# EAGLE design 512kB-v11 (EAGLE 8.3.1)
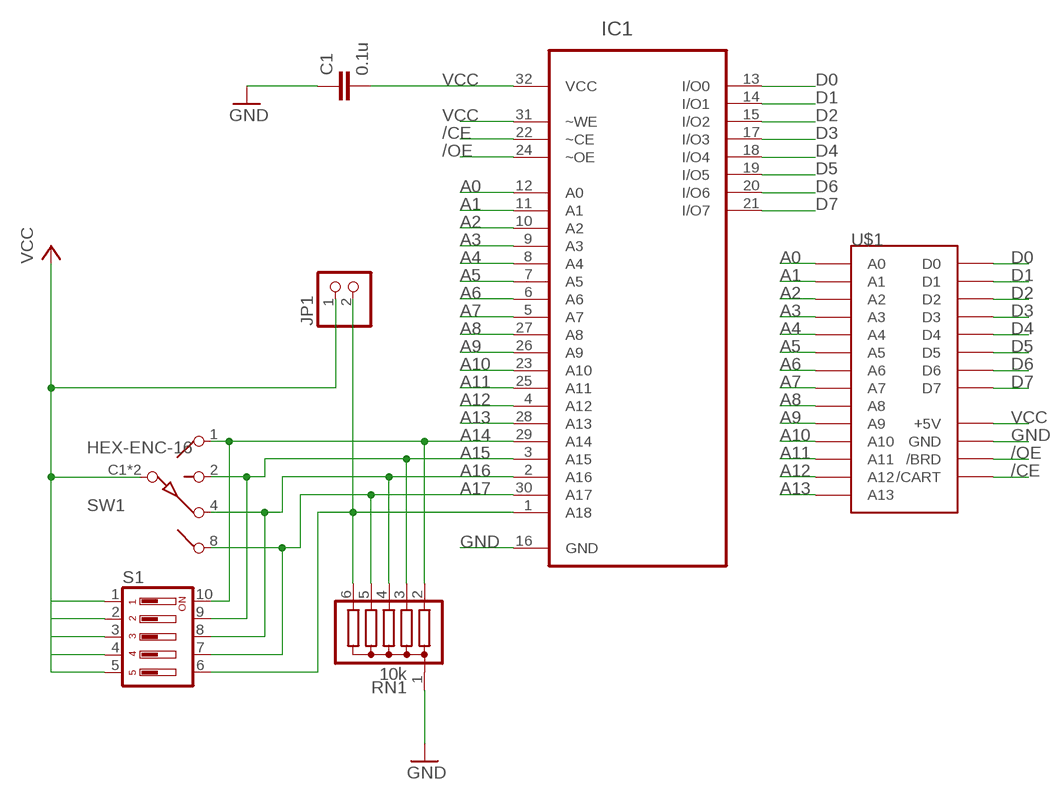
[diagram p0: schematic, sheet 1]

## Parts
C1  0.1u  C-EU050-024X044  [C050-024X044]
IC1  AT29C040  [DIP254P1524X482-32]
JP1  PINHD-1X2  [1X02]
RN1  10k  G05R  [SIL6]
S1  DIP05YL  [DIP05YL]
SW1  HEX-ENC-16  SW-C16  [SW-C16]
U$1  TVC-CARD+  [TVC-CART-CARD]

## Nets
/CE: IC1.22(~CE) U$1.BTM23(/CART)
/OE: IC1.24(~OE) U$1.BTM24(/BRD)
A0: IC1.12(A0) U$1.TOP25(A0)
A1: IC1.11(A1) U$1.TOP2(A1)
A2: IC1.10(A2) U$1.TOP24(A2)
A3: IC1.9(A3) U$1.TOP1(A3)
A4: IC1.8(A4) U$1.TOP21(A4)
A5: IC1.7(A5) U$1.TOP14(A5)
A6: IC1.6(A6) U$1.TOP18(A6)
A7: IC1.5(A7) U$1.TOP17(A7)
A8: IC1.27(A8) U$1.TOP15(A8)
A9: IC1.26(A9) U$1.TOP19(A9)
A10: IC1.23(A10) U$1.TOP22(A10)
A11: IC1.25(A11) U$1.TOP20(A11)
A12: IC1.4(A12) U$1.TOP16(A12)
A13: IC1.28(A13) U$1.TOP23(A13)
A14: IC1.29(A14) RN1.2 S1.10 SW1.1
A15: IC1.3(A15) RN1.3 S1.9 SW1.2
A16: IC1.2(A16) RN1.4 S1.8 SW1.4
A17: IC1.30(A17) RN1.5 S1.7 SW1.8
D0: IC1.13(I/O0) U$1.TOP4(D0)
D1: IC1.14(I/O1) U$1.TOP5(D1)
D2: IC1.15(I/O2) U$1.TOP6(D2)
D3: IC1.17(I/O3) U$1.TOP7(D3)
D4: IC1.18(I/O4) U$1.TOP8(D4)
D5: IC1.19(I/O5) U$1.TOP9(D5)
D6: IC1.20(I/O6) U$1.TOP10(D6)
D7: IC1.21(I/O7) U$1.TOP3(D7)
GND [Power]: C1.1 IC1.16(GND) RN1.1 U$1.BTM1(GND) U$1.BTM2(GND) U$1.BTM3(GND) U$1.BTM4(GND) U$1.BTM5(GND) U$1.BTM6(GND) U$1.BTM7(GND) U$1.BTM8(GND)
N$1: IC1.1(A18) JP1.2 RN1.6 S1.6
VCC [Power]: C1.2 IC1.31(~WE) IC1.32(VCC) JP1.1 S1.1 S1.2 S1.3 S1.4 S1.5 SW1.C1(C) SW1.C2(C) U$1.BTM10(+5V) U$1.BTM11(+5V) U$1.BTM12(+5V) U$1.BTM13(+5V) U$1.BTM14(+5V) U$1.BTM15(+5V) U$1.BTM16(+5V) U$1.BTM17(+5V)

## Library data of the parts
C1 = rcl:C-EU: CAPACITOR, European symbol
IC1 = AT29C040:AT29C040
JP1 = pinhead:PINHD-1X2: PIN HEADER
RN1 = resistor-sil:G05R: SIL RESISTOR; OC_FARNELL: unknown; OC_NEWARK: unknown
S1 = switch-dil:DIP05YL: DIL/CODE SWITCH; OC_FARNELL: unknown; OC_NEWARK: unknown
SW1 = rotary-hq-encoder160:SW-C16: SWITCH 16-step rotary switch ENCODER160 in hqelektronika.hu
U$1 = tvc-cart:TVC-CARD+

## Net classes
1 Power: width 0.508 mm

## Board
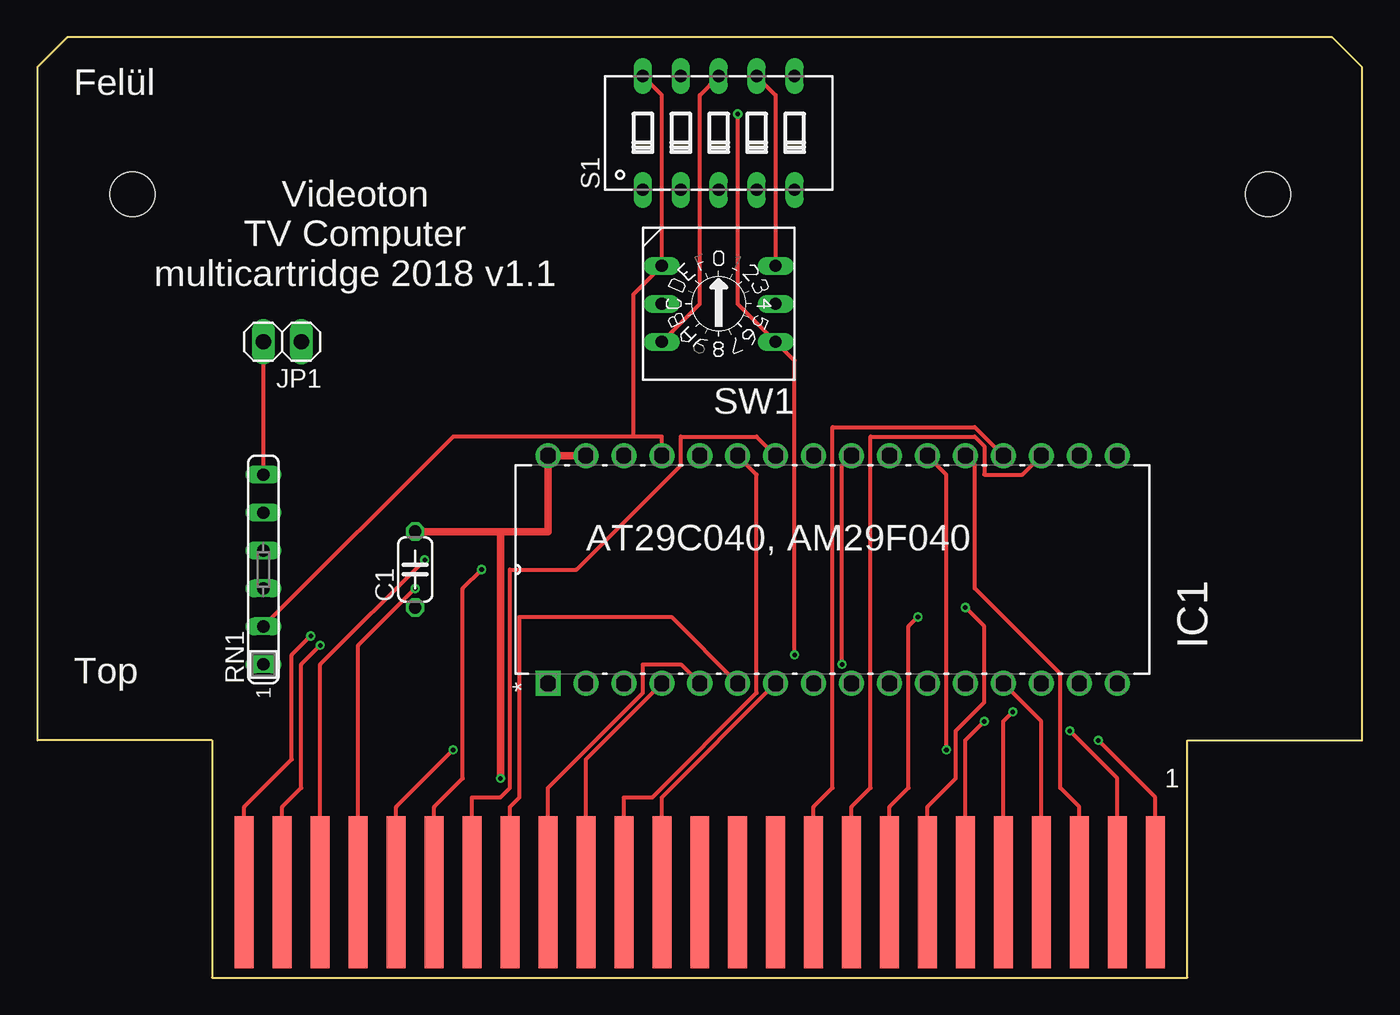
[diagram p1: board, top side]
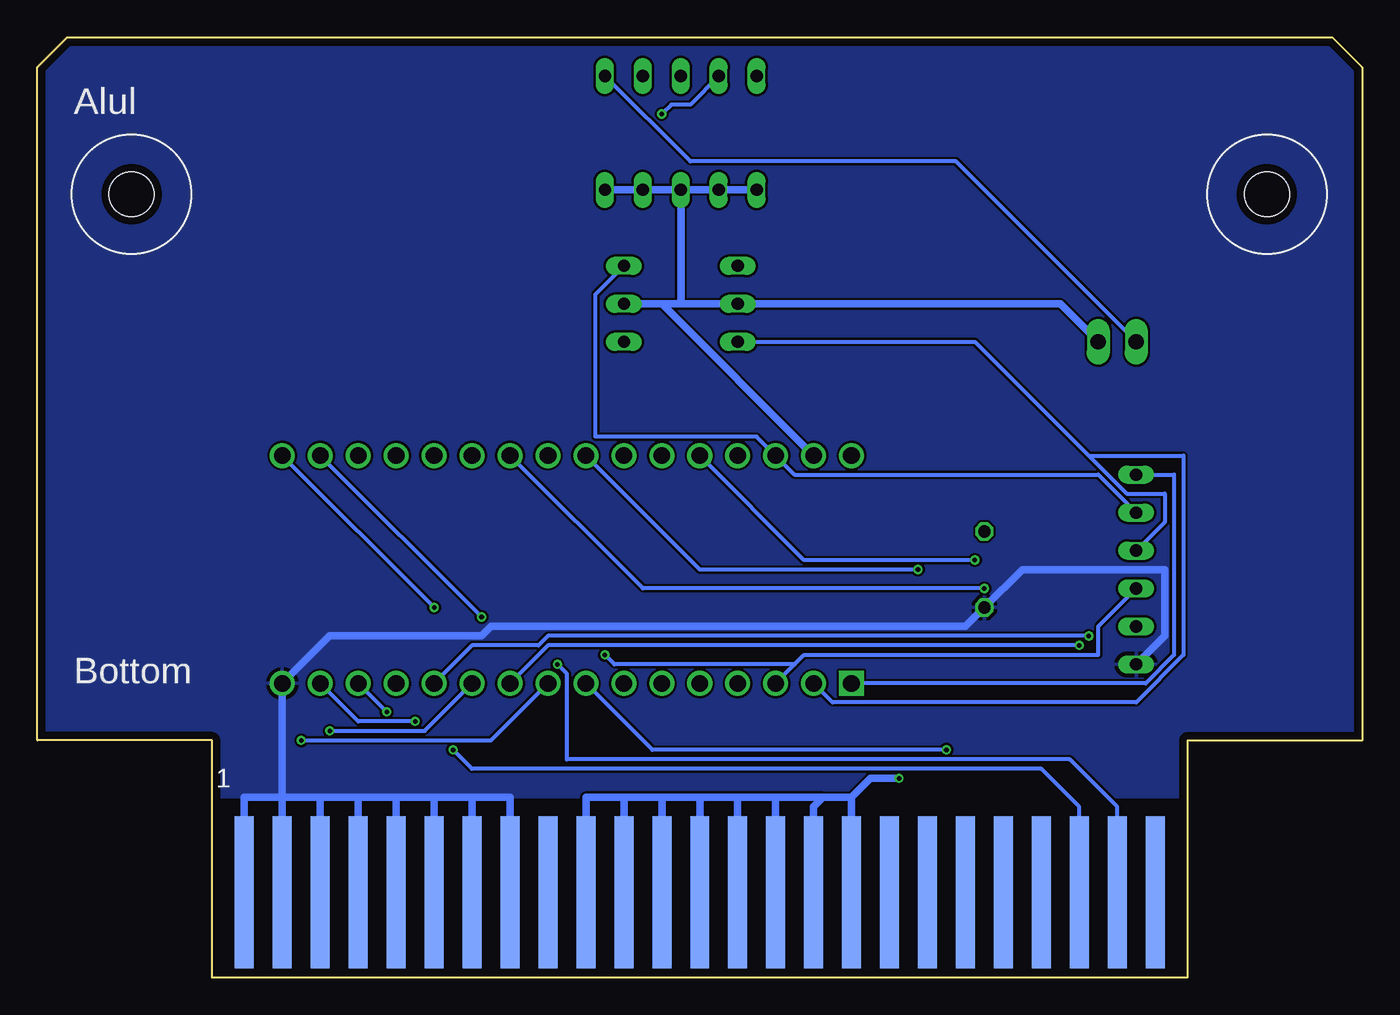
[diagram p2: board, bottom side, seen from below]

Size 88.68 x 62.91 mm. Coordinates in mm from the lower left corner, seen from the top.
Copper layers (1*16): Top 0.035mm / dielectric 1.6mm / Bottom 0.035mm
Design rules "Elecrow_2-layer_PCB_eagle_rule *": minimum track width 10mil, minimum drill 12mil, track to track 6mil, track to pad 6mil, pad to pad 6mil, via to via 8mil, smd to smd 0mil, copper to edge 20mil, drill to drill 10mil, minimum pad ring 6mil, minimum via ring 6mil, stop-mask expansion 0mil, vias tented up to drill 100mil, thermal gap 10mil

### Footprints (pad centres in the part's own frame; a part is rotated, then mirrored left to right if it is on the bottom)
C050-024X044 = drill 0.813 octagon: 1 -2.54,0; 2 2.54,0
DIP254P1524X482-32 = drill 1.118 square: 1 -15.24,33.02 | drill 1.118: 2 -15.24,30.48; 3 -15.24,27.94; 4 -15.24,25.4; 5 -15.24,22.86; 6 -15.24,20.32; 7 -15.24,17.78; 8 -15.24,15.24; 9 -15.24,12.7; 10 -15.24,10.16; 11 -15.24,7.62; 12 -15.24,5.08; 13 -15.24,2.54; 14 -15.24,0; 15 -15.24,-2.54; 16 -15.24,-5.08; 17 0,-5.08; 18 0,-2.54; 19 0,0; 20 0,2.54; 21 0,5.08; 22 0,7.62; 23 0,10.16; 24 0,12.7; 25 0,15.24; 26 0,17.78; 27 0,20.32; 28 0,22.86; 29 0,25.4; 30 0,27.94; 31 0,30.48; 32 0,33.02
1X02 = drill 1.016 long: 1 -1.27,0; 2 1.27,0
SIL6 = drill 0.813 long: 1 -6.35,0; 2 -3.81,0; 3 -1.27,0; 4 1.27,0; 5 3.81,0; 6 6.35,0
DIP05YL = drill 0.813 long: 1 -5.08,-3.81; 2 -2.54,-3.81; 3 0,-3.81; 4 2.54,-3.81; 5 5.08,-3.81; 6 5.08,3.81; 7 2.54,3.81; 8 0,3.81; 9 -2.54,3.81; 10 -5.08,3.81
SW-C16 = drill 0.813 long: 1 3.81,-2.54; 2 -3.81,2.54; 4 3.81,2.54; 8 -3.81,-2.54; C1 3.81,0; C2 -3.81,0
TVC-CART-CARD = smd 1.27 x 10.16 bottom: BTM1 29.21,-6.35; BTM2 26.67,-6.35; BTM3 24.13,-6.35; BTM4 21.59,-6.35; BTM5 19.05,-6.35; BTM6 16.51,-6.35; BTM7 13.97,-6.35; BTM8 11.43,-6.35; BTM9 8.89,-6.35; BTM10 6.35,-6.35; BTM11 3.81,-6.35; BTM12 1.27,-6.35; BTM13 -1.27,-6.35; BTM14 -3.81,-6.35; BTM15 -6.35,-6.35; BTM16 -8.89,-6.35; BTM17 -11.43,-6.35; BTM18 -13.97,-6.35; BTM19 -16.51,-6.35; BTM20 -19.05,-6.35; BTM21 -21.59,-6.35; BTM22 -24.13,-6.35; BTM23 -26.67,-6.35; BTM24 -29.21,-6.35; BTM25 -31.75,-6.35 | smd 1.27 x 10.16: TOP1 29.21,-6.35; TOP2 26.67,-6.35; TOP3 24.13,-6.35; TOP4 21.59,-6.35; TOP5 19.05,-6.35; TOP6 16.51,-6.35; TOP7 13.97,-6.35; TOP8 11.43,-6.35; TOP9 8.89,-6.35; TOP10 6.35,-6.35; TOP11 3.81,-6.35; TOP12 1.27,-6.35; TOP13 -1.27,-6.35; TOP14 -3.81,-6.35; TOP15 -6.35,-6.35; TOP16 -8.89,-6.35; TOP17 -11.43,-6.35; TOP18 -13.97,-6.35; TOP19 -16.51,-6.35; TOP20 -19.05,-6.35; TOP21 -21.59,-6.35; TOP22 -24.13,-6.35; TOP23 -26.67,-6.35; TOP24 -29.21,-6.35; TOP25 -31.75,-6.35 | hole 3: -39.24,40.35; 36.76,40.35

### Placement (x,y rotation side)
C1  25.29,27.3 90 top
IC1  67.2,34.92 90 top
JP1  16.4,42.54 180 top
RN1  15.13,27.3 90 top
S1  45.61,56.51 0 top
SW1  45.61,45.08 180 top
U$1  45.61,12.06 0 top

### Tracks (layer width: path | path; a pad name or v marks a point on that pad's centre or on a via)
/CE  (via drill 0.3)
  Top 0.254: IC1.22 60.85,33.65 v60.85,15.24
  Bottom 0.254: v60.85,15.24 59.58,13.97 21.48,13.97 18.94,11.43 U$1.BTM23
/OE  (via drill 0.3)
  Top 0.254: IC1.24 53.86,34.29 v53.86,20.95
  Bottom 0.254: v53.86,20.95 53.23,20.32 53.23,14.6 19.57,14.6 16.4,11.43 U$1.BTM24
A0  (via drill 0.3)
  Top 0.254: v18.3,22.86 17.03,21.59 17.03,14.6 13.86,11.43 U$1.TOP25
  Bottom 0.254: IC1.12 59.58,22.23 55.13,22.23 54.5,22.86 v18.3,22.86
A1  (via drill 0.3)
  Top 0.254: v69.1,16.51 72.28,13.33 U$1.TOP2
  Bottom 0.254: IC1.11 62.75,16.51 v69.1,16.51
A2  (via drill 0.3)
  Top 0.254: v18.94,22.23 17.67,20.95 17.67,12.7 16.4,11.43 U$1.TOP24
  Bottom 0.254: IC1.10 54.5,22.23 v18.94,22.23
A3  (via drill 0.3)
  Top 0.254: v71.01,15.87 74.82,12.06 U$1.TOP1
  Bottom 0.254: IC1.9 58.31,15.87 v71.01,15.87
A4  (via drill 0.3)
  Top 0.254: v27.83,15.24 24.02,11.43 U$1.TOP21
  Bottom 0.254: IC1.8 47.51,15.24 v27.83,15.24
A5
  Top 0.254: IC1.7 41.8,12.06 U$1.TOP14
A6
  Top 0.254: IC1.6 42.43,24.13 32.27,24.13 32.27,12.06 31.64,11.43 U$1.TOP18
A7
  Top 0.254: IC1.5 43.07,20.95 40.53,20.95 40.53,19.05 34.18,12.7 U$1.TOP17
A8
  Top 0.254: IC1.27 48.15,33.65 48.15,19.05 41.16,12.06 39.26,12.06 U$1.TOP15
A9
  Top 0.254: IC1.26 48.15,36.19 43.07,36.19 43.07,34.29 36.08,27.3 31.64,27.3 31.64,12.7 31,12.06 29.1,12.06 U$1.TOP19
A10  (via drill 0.3)
  Top 0.254: v25.29,26.03 21.48,22.23 U$1.TOP22
  Bottom 0.254: IC1.23 48.15,26.03 v25.29,26.03
A11  (via drill 0.3)
  Top 0.254: v29.73,27.3 28.46,26.03 28.46,13.33 26.56,11.43 U$1.TOP20
  Bottom 0.254: IC1.25 44.34,27.3 v29.73,27.3
A12
  Top 0.254: IC1.4 36.72,14.6 U$1.TOP16
A13  (via drill 0.3)
  Top 0.254: v25.92,27.94 18.94,20.95 U$1.TOP23
  Bottom 0.254: IC1.28 37.35,27.94 v25.92,27.94
A14
  Top 0.254: S1.10 41.8,59.05 SW1.1 39.89,45.72 39.89,36.19 | RN1.2 27.83,36.19 39.89,36.19 | 39.89,36.19 41.8,36.19 IC1.29
A15  (via drill 0.3)
  Top 0.254: v46.88,57.78 46.88,45.08 SW1.2 50.69,41.27 v50.69,21.59
  Bottom 0.254: v46.88,57.78 46.24,58.42 44.97,58.42 S1.9 | RN1.3 17.67,23.49 17.67,21.59 37.35,21.59 37.99,20.95 | IC1.3 37.99,20.95 | v50.69,21.59 50.05,20.95 37.99,20.95
A16
  Top 0.254: S1.8 44.34,59.05 44.34,45.08 SW1.4
  Bottom 0.254: RN1.4 13.22,30.48 13.22,32.38 15.76,32.38 18.3,34.92 | 18.3,34.92 25.92,42.54 SW1.4 | IC1.2 35.45,18.41 15.13,18.41 11.95,21.59 11.95,34.92 18.3,34.92
A17
  Top 0.254: SW1.8 49.42,59.05 S1.7
  Bottom 0.254: RN1.5 17.67,33.65 37.99,33.65 IC1.30 40.53,36.19 51.32,36.19 51.32,45.72 SW1.8
D0
  Top 0.254: IC1.13 67.2,17.14 U$1.TOP4
D1  (via drill 0.3)
  Top 0.254: v65.29,17.78 64.66,17.14 U$1.TOP5
  Bottom 0.254: v65.29,17.78 IC1.14
D2  (via drill 0.3)
  Top 0.254: v63.39,17.14 62.12,15.87 U$1.TOP6
  Bottom 0.254: IC1.15 67.2,17.14 v63.39,17.14
D3  (via drill 0.3)
  Top 0.254: v62.12,24.77 63.39,23.49 63.39,18.41 61.48,16.51 61.48,13.33 59.58,11.43 U$1.TOP7
  Bottom 0.254: v62.12,24.77 IC1.17
D4  (via drill 0.3)
  Top 0.254: v58.94,24.13 58.31,23.49 58.31,12.7 57.04,11.43 U$1.TOP8
  Bottom 0.254: v58.94,24.13 IC1.18
D5
  Top 0.254: IC1.19 65.93,33.65 63.39,33.65 63.39,35.56 62.75,36.19 55.77,36.19 55.77,12.7 54.5,11.43 U$1.TOP9
D6
  Top 0.254: IC1.20 62.75,36.83 53.23,36.83 53.23,12.7 51.96,11.43 U$1.TOP10
D7
  Top 0.254: IC1.21 62.75,34.29 62.75,26.03 68.47,20.32 68.47,12.7 69.74,11.43 U$1.TOP3
GND
  Bottom 0.508: RN1.1 13.22,22.86 13.22,27.3 22.75,27.3 C1.1 26.56,23.49 58.31,23.49 58.94,22.86 69.1,22.86 IC1.16 72.28,12.06 | U$1.BTM2 72.28,12.06 | U$1.BTM8 57.04,12.06 59.58,12.06 | 72.28,12.06 69.74,12.06 | 69.74,12.06 67.2,12.06 | 67.2,12.06 64.66,12.06 | 64.66,12.06 62.12,12.06 | 62.12,12.06 59.58,12.06 | 59.58,12.06 U$1.BTM7 | 62.12,12.06 U$1.BTM6 | 64.66,12.06 U$1.BTM5 | 67.2,12.06 U$1.BTM4 | 69.74,12.06 U$1.BTM3 | U$1.BTM1 74.82,12.06 72.28,12.06
  pour Bottom: 1.16,62.86 -0.11,61.59 -0.11,15.87 11.32,15.87 11.32,12.06 77.36,12.06 77.36,15.87 88.79,15.87 88.79,61.59 87.52,62.86
N$1
  Top 0.254: JP1.2 RN1.6
  Bottom 0.254: S1.6 44.97,54.61 27.19,54.61 JP1.2 | IC1.1 14.49,19.68 12.59,21.59 12.59,33.65 RN1.6
VCC  (via drill 0.3)
  Top 0.508: 31,29.84 34.18,29.84 IC1.32 IC1.31 | 31,29.84 C1.2 | 31,29.84 v31,13.33
  Bottom 0.508: 34.18,12.06 U$1.BTM17 | 36.08,12.06 34.18,12.06 | 36.08,12.06 36.72,11.43 U$1.BTM16 | 39.26,12.06 U$1.BTM15 | 36.08,12.06 39.26,12.06 | 41.8,12.06 U$1.BTM14 | 39.26,12.06 41.8,12.06 | 44.34,12.06 U$1.BTM13 | 41.8,12.06 44.34,12.06 | 46.88,12.06 U$1.BTM12 | 44.34,12.06 46.88,12.06 | 49.42,12.06 U$1.BTM11 | 46.88,12.06 49.42,12.06 | U$1.BTM10 51.96,12.06 49.42,12.06 | S1.1 S1.2 S1.3 | S1.3 S1.4 S1.5 | SW1.C2 46.88,45.08 | 46.88,45.08 45.61,45.08 | 45.61,45.08 SW1.C1 20.21,45.08 JP1.1 | 45.61,45.08 S1.3 | 46.88,45.08 IC1.31 | 34.18,12.06 32.91,13.33 v31,13.33

### Text on the board
tPlace: Felül | Videoton / TV Computer / multicartridge 2018 v1.1 | AT29C040, AM29F040 | Top
bPlace: Alul | Bottom